# EAGLE design CF Grove Cape  v0.1 (EAGLE 8.0.2)

## Sheet 1 of 2
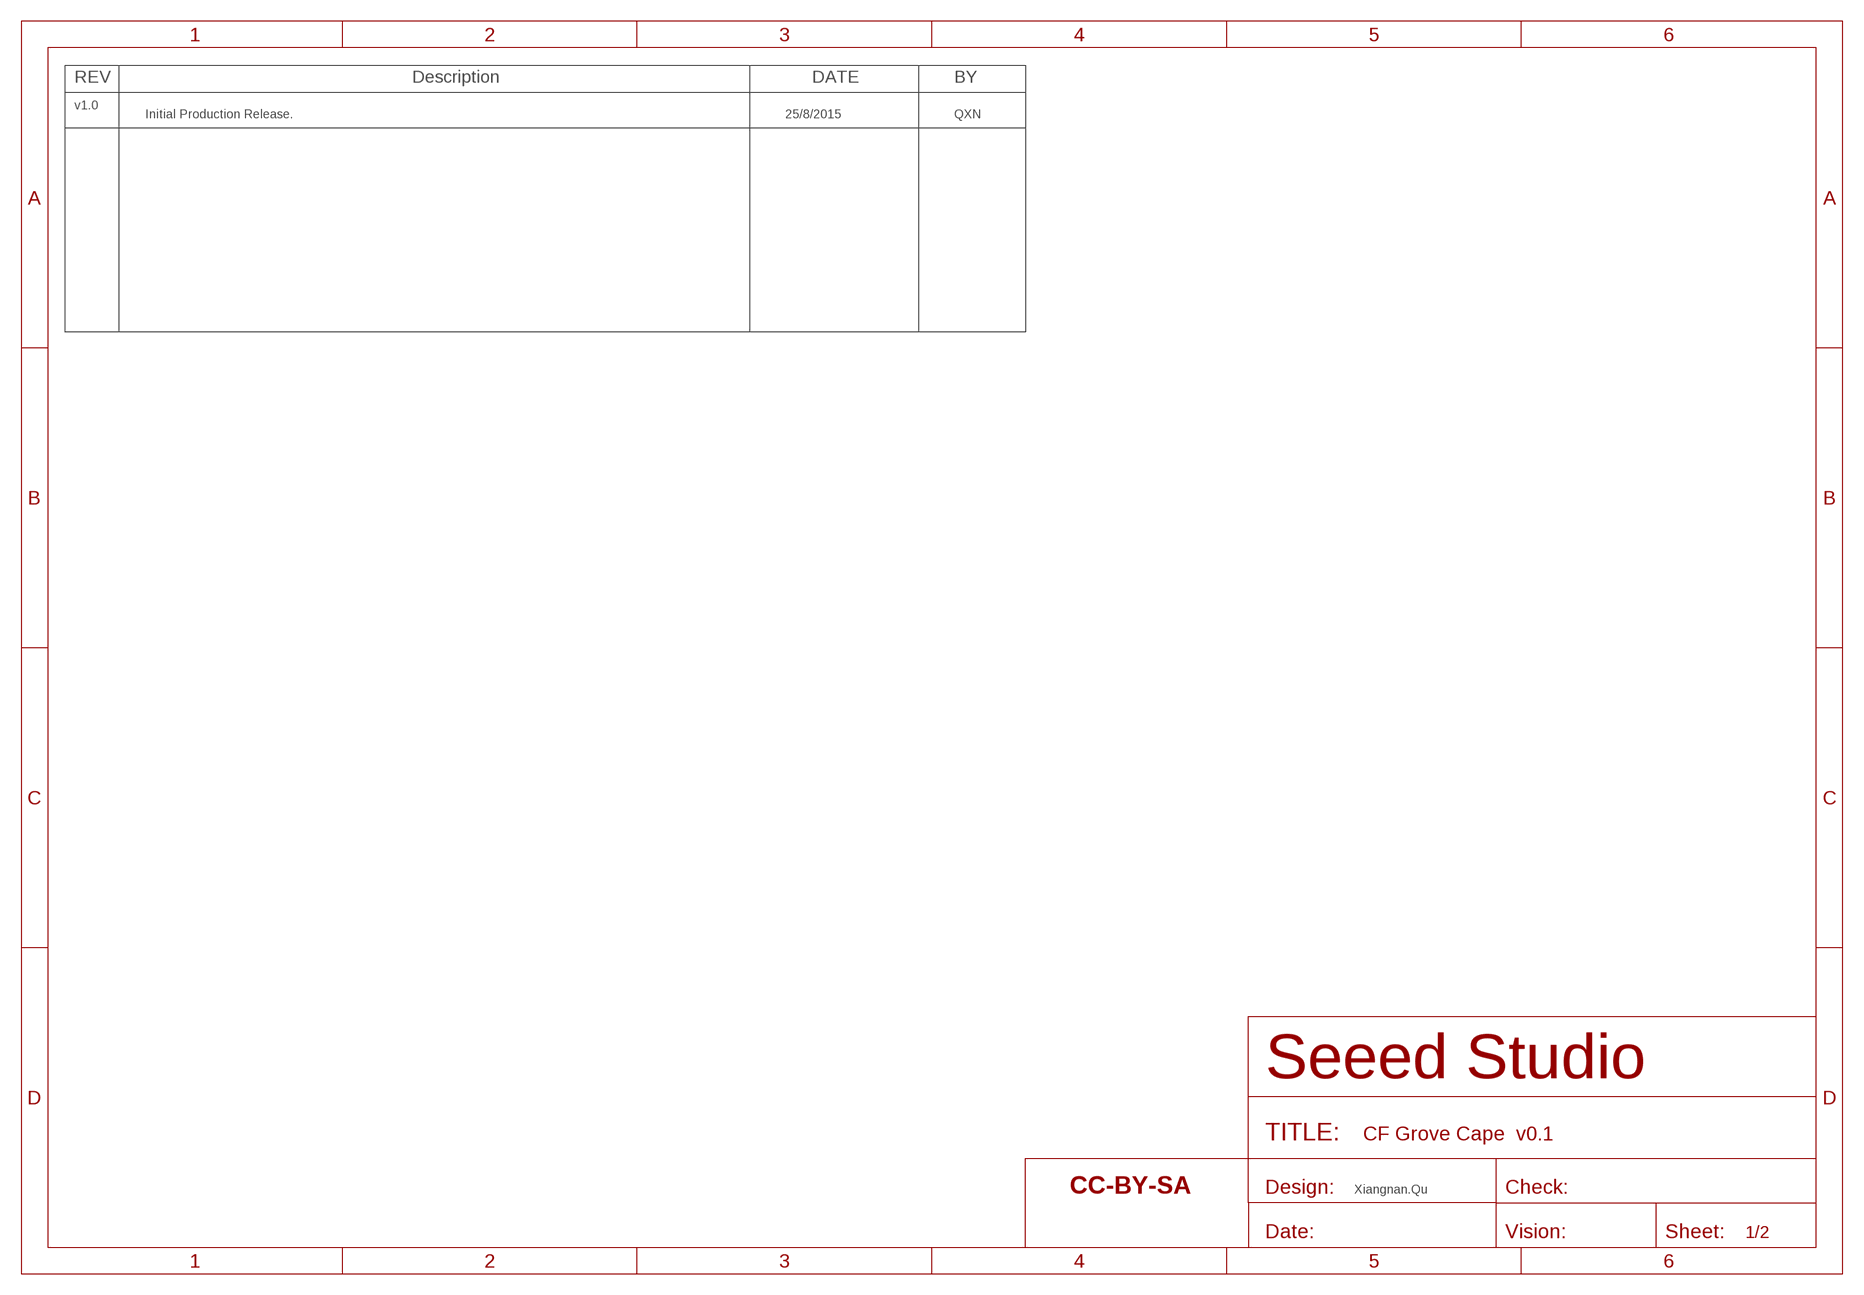
[diagram p0: schematic, sheet 1]

### Parts
FR1  SEEEDSTUDIO-OPEN-SCH-FRAME  [SEEEDSTUDIO-PCB-FRAME]

### Notes on the sheet
- REV | Description | DATE | BY
- v1.0
- Initial Production Release. | 25/8/2015 | QXN
- Xiangnan.Qu

## Sheet 2 of 2
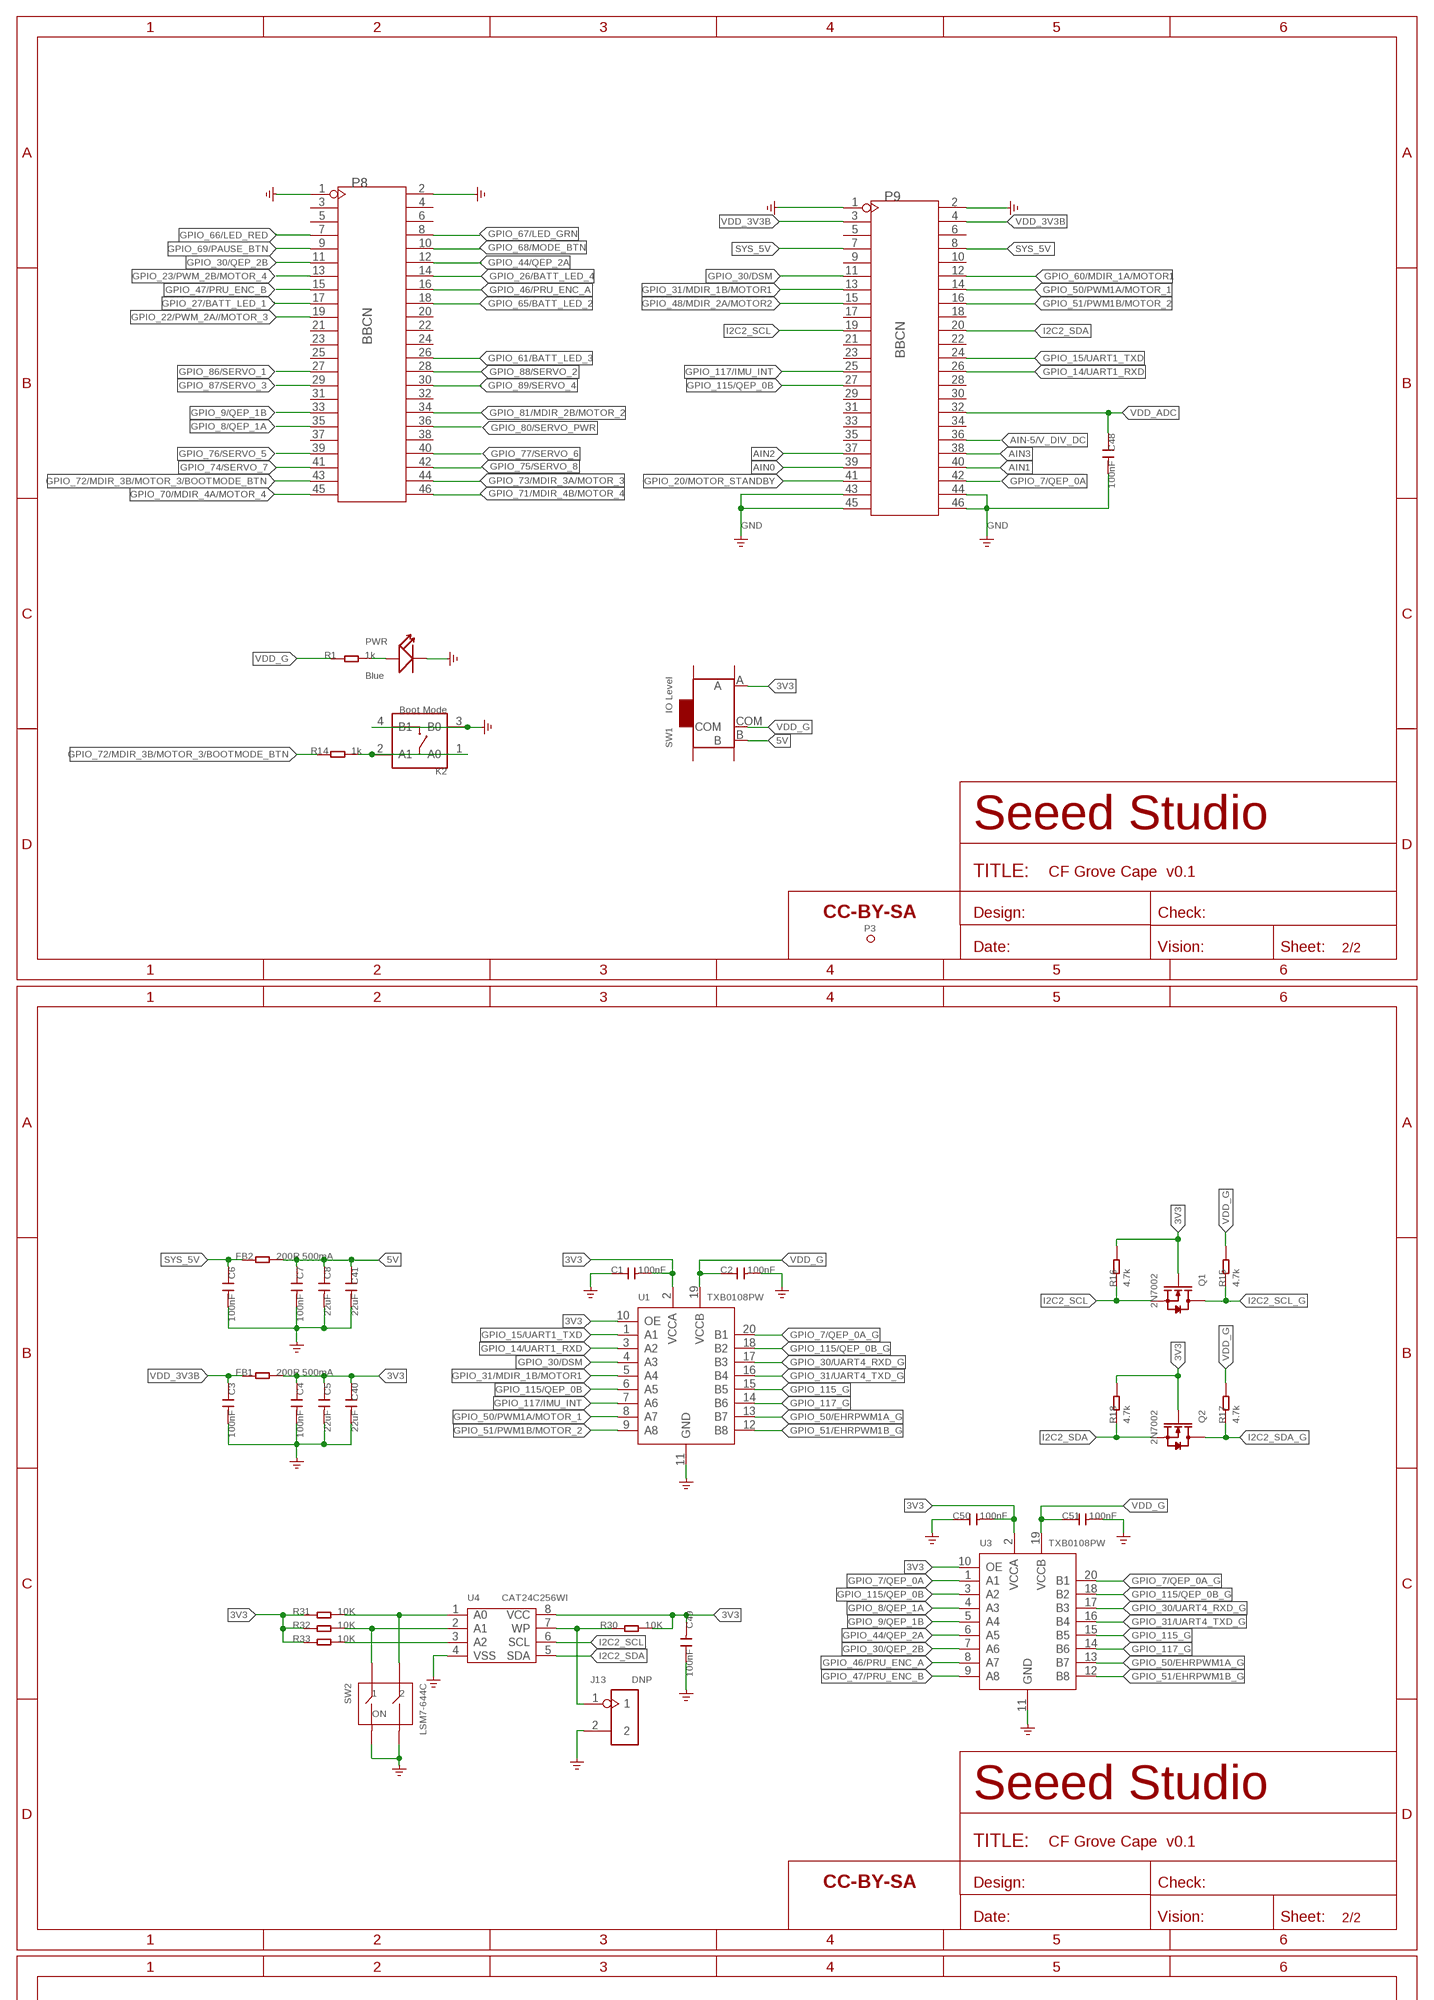
[diagram p1: schematic, sheet 2, part 1 of 2]
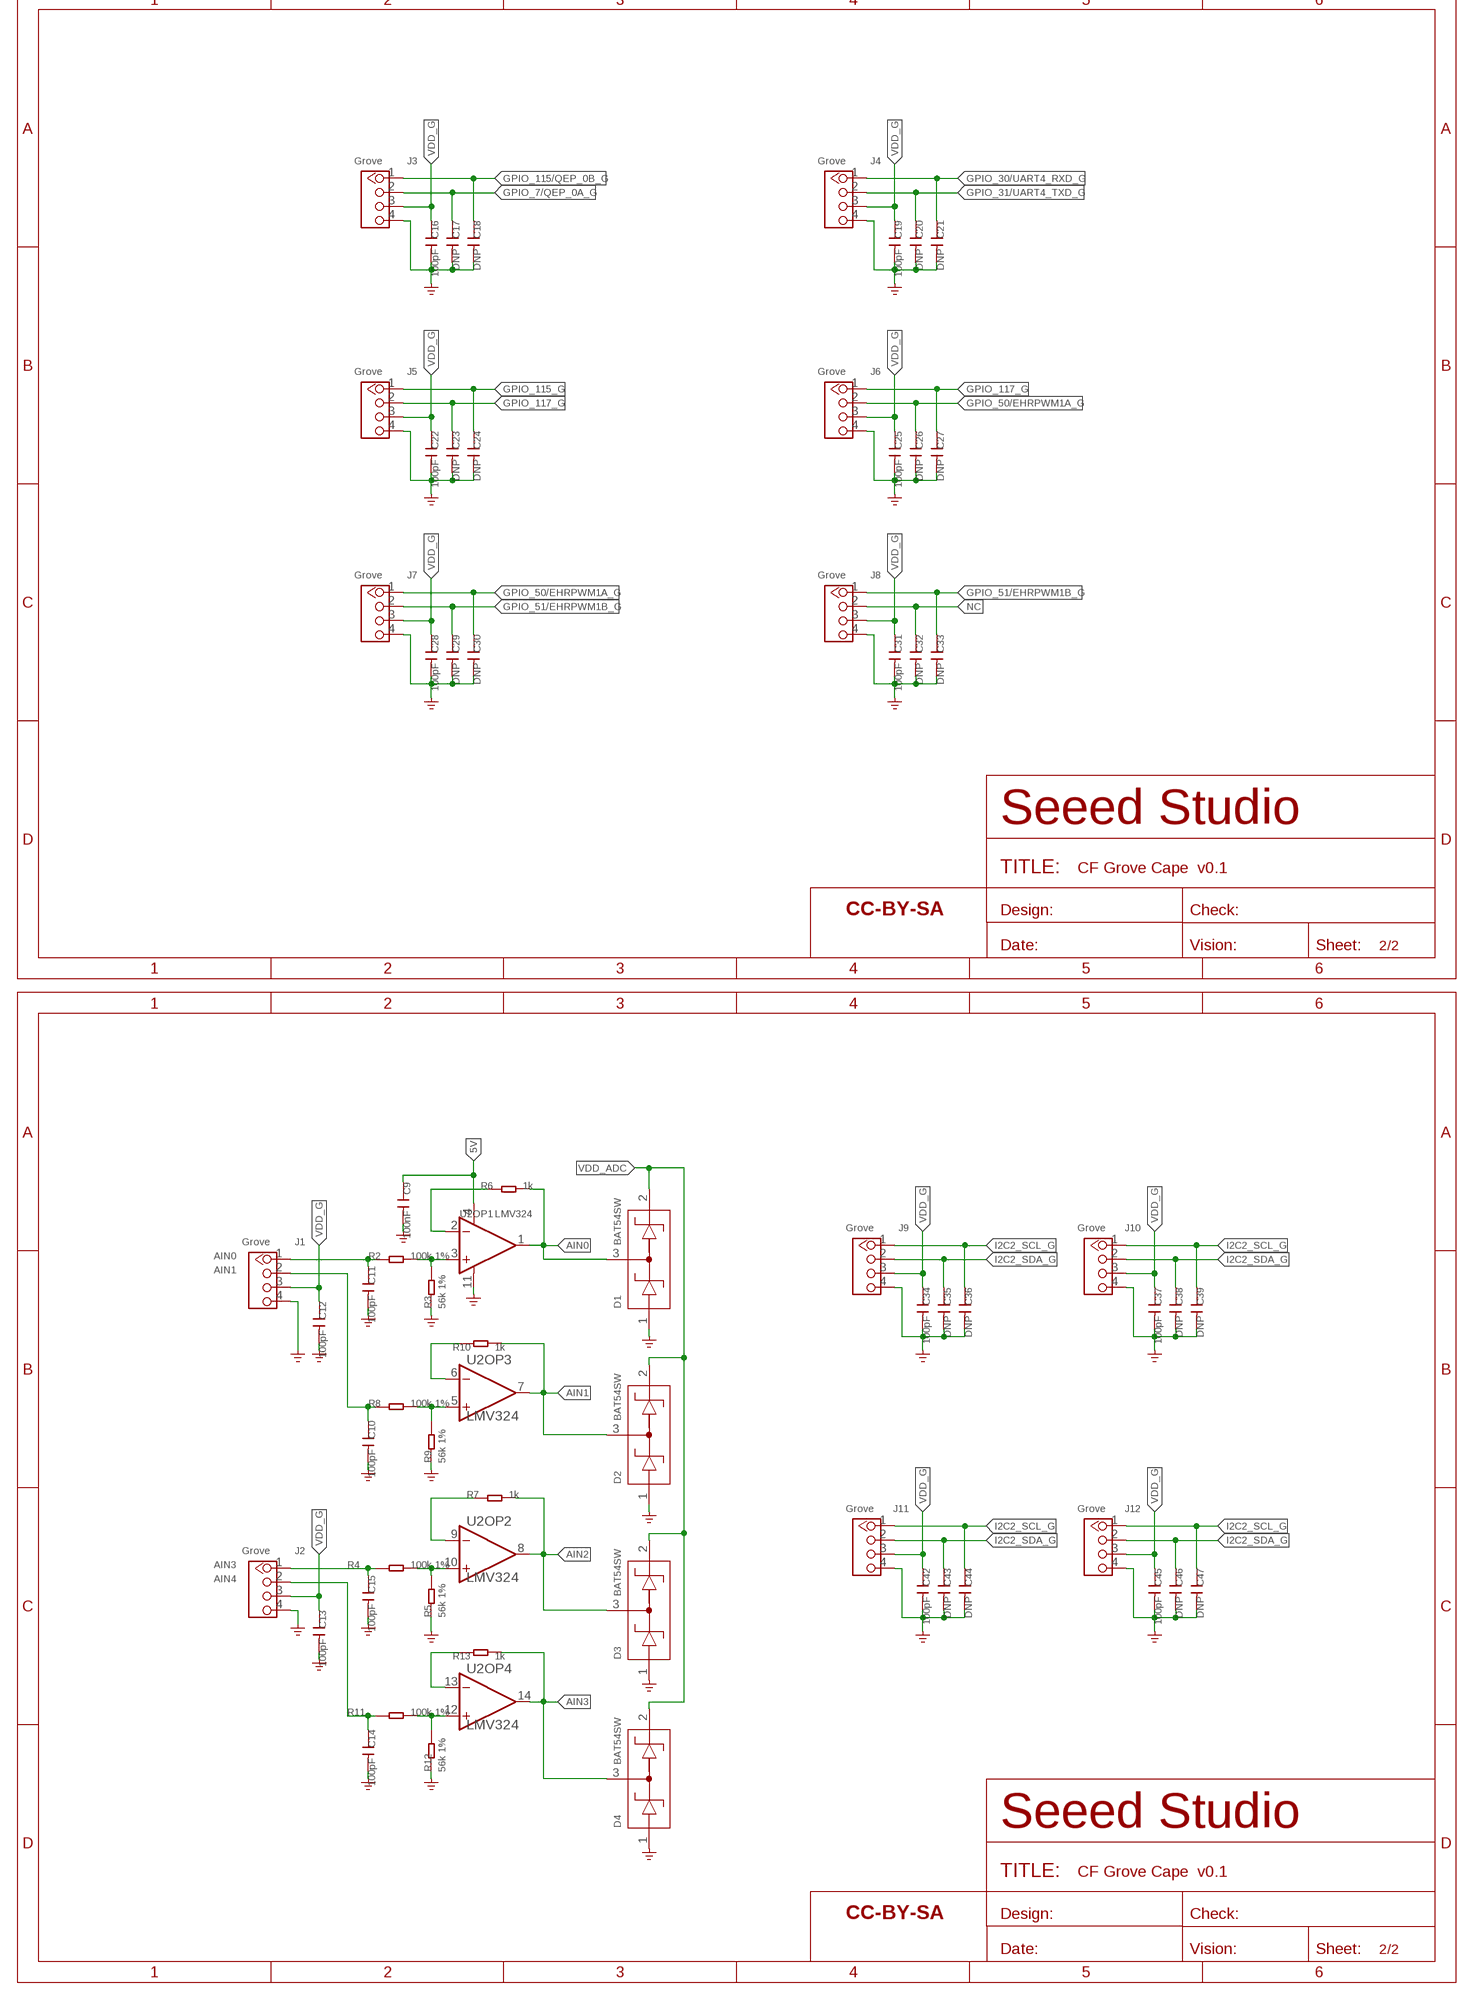
[diagram p2: schematic, sheet 2, part 2 of 2]

### Parts
C1  100nF  CAP-0402  [C0402]
C2  100nF  CAP-0402  [C0402]
C3  100nF  CAP-0402  [C0402]
C4  100nF  CAP-0402  [C0402]
C5  22uF  CAP-0805  [C0805]
C6  100nF  CAP-0402  [C0402]
C7  100nF  CAP-0402  [C0402]
C8  22uF  CAP-0805  [C0805]
C9  100nF  CAP-0402  [C0402]
C10  100pF  CAP-0402  [C0402]
C11  100pF  CAP-0402  [C0402]
C12  100pF  CAP-0402  [C0402]
C13  100pF  CAP-0402  [C0402]
C14  100pF  CAP-0402  [C0402]
C15  100pF  CAP-0402  [C0402]
C16  100pF  CAP-0402  [C0402]
C17  DNP  CAP-0402  [C0402]
C18  DNP  CAP-0402  [C0402]
C19  100pF  CAP-0402  [C0402]
C20  DNP  CAP-0402  [C0402]
C21  DNP  CAP-0402  [C0402]
C22  100pF  CAP-0402  [C0402]
C23  DNP  CAP-0402  [C0402]
C24  DNP  CAP-0402  [C0402]
C25  100pF  CAP-0402  [C0402]
C26  DNP  CAP-0402  [C0402]
C27  DNP  CAP-0402  [C0402]
C28  100pF  CAP-0402  [C0402]
C29  DNP  CAP-0402  [C0402]
C30  DNP  CAP-0402  [C0402]
C31  100pF  CAP-0402  [C0402]
C32  DNP  CAP-0402  [C0402]
C33  DNP  CAP-0402  [C0402]
C34  100pF  CAP-0402  [C0402]
C35  DNP  CAP-0402  [C0402]
C36  DNP  CAP-0402  [C0402]
C37  100pF  CAP-0402  [C0402]
C38  DNP  CAP-0402  [C0402]
C39  DNP  CAP-0402  [C0402]
C40  22uF  CAP-0805  [C0805]
C41  22uF  CAP-0805  [C0805]
C42  100pF  CAP-0402  [C0402]
C43  DNP  CAP-0402  [C0402]
C44  DNP  CAP-0402  [C0402]
C45  100pF  CAP-0402  [C0402]
C46  DNP  CAP-0402  [C0402]
C47  DNP  CAP-0402  [C0402]
C48  100nF  CAP-0402  [C0402]
C49  100nF  CAP-0402  [C0402]
C50  100nF  CAP-0402  [C0402]
C51  100nF  CAP-0402  [C0402]
D1  BAT54SW  D-SCHOTTKY-3P（BAT54SW)  [SOT-23]
D2  BAT54SW  D-SCHOTTKY-3P（BAT54SW)  [SOT-23]
D3  BAT54SW  D-SCHOTTKY-3P（BAT54SW)  [SOT-23]
D4  BAT54SW  D-SCHOTTKY-3P（BAT54SW)  [SOT-23]
FB1  200R 500mA  RES-0603  [R0603]
FB2  200R 500mA  RES-0603  [R0603]
FR2  SEEEDSTUDIO-OPEN-SCH-FRAME  [SEEEDSTUDIO-PCB-FRAME]
FR3  SEEEDSTUDIO-OPEN-SCH-FRAME  [SEEEDSTUDIO-PCB-FRAME]
FR4  SEEEDSTUDIO-OPEN-SCH-FRAME  [SEEEDSTUDIO-PCB-FRAME]
FR5  SEEEDSTUDIO-OPEN-SCH-FRAME  [SEEEDSTUDIO-PCB-FRAME]
J1  Grove  GROVE-CONNECTOR-DIP-2.0  [HW4-2.0]
J2  Grove  GROVE-CONNECTOR-DIP-2.0  [HW4-2.0]
J3  Grove  GROVE-CONNECTOR-DIP-2.0  [HW4-2.0]
J4  Grove  GROVE-CONNECTOR-DIP-2.0  [HW4-2.0]
J5  Grove  GROVE-CONNECTOR-DIP-2.0  [HW4-2.0]
J6  Grove  GROVE-CONNECTOR-DIP-2.0  [HW4-2.0]
J7  Grove  GROVE-CONNECTOR-DIP-2.0  [HW4-2.0]
J8  Grove  GROVE-CONNECTOR-DIP-2.0  [HW4-2.0]
J9  Grove  GROVE-CONNECTOR-DIP-2.0  [HW4-2.0]
J10  Grove  GROVE-CONNECTOR-DIP-2.0  [HW4-2.0]
J11  Grove  GROVE-CONNECTOR-DIP-2.0  [HW4-2.0]
J12  Grove  GROVE-CONNECTOR-DIP-2.0  [HW4-2.0]
J13  DNP  HEADER-2P-1.5  [H2-1.5]
K2  Boot Mode  BUTTON-4P-4.5X3.2  [SW4P-SMD-4.5X3.2X2.5MM]
P3  MARK-1.0'ANNULAR'  [ROUND-MARK-1.0]
P8  BBCN  HEADER-2X23P  [2X23P-2.54]
P9  BBCN  HEADER-2X23P  [2X23P-2.54]
PWR  Blue  LED-0402  [LED-0402]
Q1  2N7002  MOSFET-N'SOT23'  [SOT-23]
Q2  2N7002  MOSFET-N'SOT23'  [SOT-23]
R1  1k  RES-0402  [R0402]
R2  100k 1%  RES-0402  [R0402]
R3  56k 1%  RES-0402  [R0402]
R4  100k 1%  RES-0402  [R0402]
R5  56k 1%  RES-0402  [R0402]
R6  1k  RES-0402  [R0402]
R7  1k  RES-0402  [R0402]
R8  100k 1%  RES-0402  [R0402]
R9  56k 1%  RES-0402  [R0402]
R10  1k  RES-0402  [R0402]
R11  100k 1%  RES-0402  [R0402]
R12  56k 1%  RES-0402  [R0402]
R13  1k  RES-0402  [R0402]
R14  1k  RES-0402  [R0402]
R15  4.7k  RES-0402  [R0402]
R16  4.7k  RES-0402  [R0402]
R17  4.7k  RES-0402  [R0402]
R18  4.7k  RES-0402  [R0402]
R30  10K  RES-0402  [R0402]
R31  10K  RES-0402  [R0402]
R32  10K  RES-0402  [R0402]
R33  10K  RES-0402  [R0402]
SW1  IO Level  SWITCH-3+4P  [SW7-SMD-L6.7X2.7X3.2MM]
SW2  LSM7-644C  SWITCHES-4P'KM-02'  [SW4-SMD-5.08X6.8X3.3MM]
U1  TXB0108PW  LOGIC-TXS0108EPWR  [TSSOP20-0.65-6.5X4.4MM]
U2  LMV324  AMPLIFIER-LMV324'PW'  [TSSOP14-0.65-5X4.4MM]
U3  TXB0108PW  LOGIC-TXS0108EPWR  [TSSOP20-0.65-6.5X4.4MM]
U4  CAT24C256WI  MCU-EEPROM-CAT24C256  [SOIC8-1.27-5X4MM]

### Nets
3V3: C1.2 C4.1 C5.1 C40.1 C49.2 C50.2 FB1.2 Q1.1(G) Q2.1(G) R16.2 R18.2 R30.1 R31.2 R32.2 R33.2 SW1.A U1.2(VCCA) U1.10(OE) U3.2(VCCA) U3.10(OE) U4.8(VCC)
5V: C7.1 C8.1 C9.1 C41.1 FB2.2 SW1.B U2.4(OP1:V+)
AIN0: D1.3 P9.39 R6.2 U2.1(OP1:OUT)
AIN1: D2.3 P9.40 R10.2 U2.7(OP3:OUT)
AIN2: D3.3 P9.37 R7.2 U2.8(OP2:OUT)
AIN3: D4.3 P9.38 R13.2 U2.14(OP4:OUT)
AIN-5/V_DIV_DC: P9.36
GND: C1.1 C2.2 C3.2 C4.2 C5.2 C6.2 C7.2 C8.2 C9.2 C10.2 C11.2 C12.2 C13.2 C14.2 C15.2 C16.2 C17.2 C18.2 C19.2 C20.2 C21.2 C22.2 C23.2 C24.2 C25.2 C26.2 C27.2 C28.2 C29.2 C30.2 C31.2 C32.2 C33.2 C34.2 C35.2 C36.2 C37.2 C38.2 C39.2 C40.2 C41.2 C42.2 C43.2 C44.2 C45.2 C46.2 C47.2 C48.2 C49.1 C50.1 C51.2 D1.1 D2.1 D3.1 D4.1 J1.4 J2.4 J3.4 J4.4 J5.4 J6.4 J7.4 J8.4 J9.4 J10.4 J11.4 J12.4 J13.2 K2.3(B0) K2.4(B1) P8.1 P8.2 P9.1 P9.2 P9.43 P9.44 P9.45 P9.46 PWR.- R3.1 R5.1 R9.1 R12.1 SW2.3 SW2.4 U1.11(GND) U2.11(OP1:V-) U3.11(GND) U4.4(VSS) ; supply symbol labelled GND_POWER
GPIO_7/QEP_0A: P9.42 U3.1(A1)
GPIO_7/QEP_0A_G: C17.1 J3.2 U1.20(B1) U3.20(B1)
GPIO_8/QEP_1A: P8.35 U3.4(A3)
GPIO_9/QEP_1B: P8.33 U3.5(A4)
GPIO_14/UART1_RXD: P9.26 U1.3(A2)
GPIO_15/UART1_TXD: P9.24 U1.1(A1)
GPIO_20/MOTOR_STANDBY: P9.41
GPIO_22/PWM_2A//MOTOR_3: P8.19
GPIO_23/PWM_2B/MOTOR_4: P8.13
GPIO_26/BATT_LED_4: P8.14
GPIO_27/BATT_LED_1: P8.17
GPIO_30/DSM: P9.11 U1.4(A3)
GPIO_30/QEP_2B: P8.11 U3.7(A6)
GPIO_30/UART4_RXD_G: C21.1 J4.1 U1.17(B3) U3.17(B3)
GPIO_31/MDIR_1B/MOTOR1: P9.13 U1.5(A4)
GPIO_31/UART4_TXD_G: C20.1 J4.2 U1.16(B4) U3.16(B4)
GPIO_44/QEP_2A: P8.12 U3.6(A5)
GPIO_46/PRU_ENC_A: P8.16 U3.8(A7)
GPIO_47/PRU_ENC_B: P8.15 U3.9(A8)
GPIO_48/MDIR_2A/MOTOR2: P9.15
GPIO_50/EHRPWM1A_G: C26.1 C30.1 J6.2 J7.1 U1.13(B7) U3.13(B7)
GPIO_50/PWM1A/MOTOR_1: P9.14 U1.8(A7)
GPIO_51/EHRPWM1B_G: C29.1 C33.1 J7.2 J8.1 U1.12(B8) U3.12(B8)
GPIO_51/PWM1B/MOTOR_2: P9.16 U1.9(A8)
GPIO_60/MDIR_1A/MOTOR1: P9.12
GPIO_61/BATT_LED_3: P8.26
GPIO_65/BATT_LED_2: P8.18
GPIO_66/LED_RED: P8.7
GPIO_67/LED_GRN: P8.8
GPIO_68/MODE_BTN: P8.10
GPIO_69/PAUSE_BTN: P8.9
GPIO_70/MDIR_4A/MOTOR_4: P8.45
GPIO_71/MDIR_4B/MOTOR_4: P8.46
GPIO_72/MDIR_3B/MOTOR_3/BOOTMODE_BTN: P8.43 R14.1
GPIO_73/MDIR_3A/MOTOR_3: P8.44
GPIO_74/SERVO_7: P8.41
GPIO_75/SERVO_8: P8.42
GPIO_76/SERVO_5: P8.39
GPIO_77/SERVO_6: P8.40
GPIO_80/SERVO_PWR: P8.36
GPIO_81/MDIR_2B/MOTOR_2: P8.34
GPIO_86/SERVO_1: P8.27
GPIO_87/SERVO_3: P8.29
GPIO_88/SERVO_2: P8.28
GPIO_89/SERVO_4: P8.30
GPIO_115/QEP_0B: P9.27 U1.6(A5) U3.3(A2)
GPIO_115/QEP_0B_G: C18.1 J3.1 U1.18(B2) U3.18(B2)
GPIO_115_G: C24.1 J5.1 U1.15(B5) U3.15(B5)
GPIO_117/IMU_INT: P9.25 U1.7(A6)
GPIO_117_G: C23.1 C27.1 J5.2 J6.1 U1.14(B6) U3.14(B6)
I2C2_SCL: P9.19 Q1.2(S) R16.1 U4.6(SCL)
I2C2_SCL_G: C36.1 C39.1 C44.1 C47.1 J9.1 J10.1 J11.1 J12.1 Q1.3(D) R15.1
I2C2_SDA: P9.20 Q2.2(S) R18.1 U4.5(SDA)
I2C2_SDA_G: C35.1 C38.1 C43.1 C46.1 J9.2 J10.2 J11.2 J12.2 Q2.3(D) R17.1
N$1: R31.1 SW2.2 U4.1(A0)
N$2: R32.1 SW2.1 U4.2(A1)
N$3: K2.1(A0) K2.2(A1) R14.2
N$4: PWR.+ R1.2
N$5: R2.2 R3.2 U2.3(OP1:IN+)
N$8: R4.2 R5.2 U2.10(OP2:IN+)
N$10: C11.1 J1.1 R2.1
N$11: R6.1 U2.2(OP1:IN-)
N$12: J13.1 R30.2 U4.7(WP)
N$13: C15.1 J2.1 R4.1
N$16: R7.1 U2.9(OP2:IN-)
N$17: R33.1 U4.3(A2)
N$21: C14.1 J2.2 R11.1
N$22: R11.2 R12.2 U2.12(OP4:IN+)
N$24: C10.1 J1.2 R8.1
N$25: R8.2 R9.2 U2.5(OP3:IN+)
N$26: R10.1 U2.6(OP3:IN-)
N$27: R13.1 U2.13(OP4:IN-)
NC: C32.1 J8.2
SYS_5V: C6.1 FB2.1 P9.7 P9.8
VDD_3V3B: C3.1 FB1.1 P9.3 P9.4
VDD_ADC: C48.1 D1.2 D2.2 D3.2 D4.2 P9.32
VDD_G: C2.1 C12.1 C13.1 C16.1 C19.1 C22.1 C25.1 C28.1 C31.1 C34.1 C37.1 C42.1 C45.1 C51.1 J1.3 J2.3 J3.3 J4.3 J5.3 J6.3 J7.3 J8.3 J9.3 J10.3 J11.3 J12.3 R1.1 R15.2 R17.2 SW1.COM U1.19(VCCB) U3.19(VCCB)
Unconnected: P8.3 P8.4 P8.5 P8.6 P8.20 P8.21 P8.22 P8.23 P8.24 P8.25 P8.31 P8.32 P8.37 P8.38 P9.5 P9.6 P9.9 P9.10 P9.17 P9.18 P9.21 P9.22 P9.23 P9.28 P9.29 P9.30 P9.31 P9.33 P9.34 P9.35 SW1.SS1 SW1.SS2 SW1.SS3 SW1.SS4

### Notes on the sheet
- AIN0
- AIN1
- AIN3
- AIN4

## Library data of the parts
C1-C51 = Discrete-new:CAP: Ceramic Capacitors
D1-D4 = Discrete-new:D-SCHOTTKY-3P（BAT54SW)
FB1 FB2 R1-R18 R30-R33 = Discrete-new:RES
FR1-FR5 = moudle-new:SEEEDSTUDIO-OPEN-SCH-FRAME
J1-J12 = Connector-new:GROVE-CONNECTOR-DIP: 4P-2.0:320110033;4P-2.0-90D:320110034
J13 = Connector-new:HEADER-2P
K2 = Discrete-new:BUTTON-4P: SW4-6.0X6.0X5.0MM:311020024;SW4-8.0X8.0X9.0MM:311020028;SW4-SMD-6.0X6.0X5.0MM:311020004;SW4-SMD-3.35X3.35X1.5MM:311020030;SW4-SMD-5.2X5.2X2.5MM:311020046
P3 = Discrete-new:MARK-1.0; PARTNO: DNP
P8 P9 = Connector :HEADER-2X23P
PWR = Discrete-new:LED
Q1 Q2 = Discrete-new:MOSFET-N
SW1 = Discrete-new:SWITCH-3+4P: SW7-SMD-6.7X2.6X1.4MM-90D:311030002;SW7-SMD-L6.7X2.7X3.2MM:311030001
SW2 = Discrete-new:SWITCHES-4P
U1 U3 = IC-new:LOGIC-TXS0108EPWR: 310050026
U2 = IC-new:AMPLIFIER-LMV324: TSSOP-14:310020008;SOIC-14:310020019
U4 = template:MCU-EEPROM-CAT24C256: 256 kb I2C CMOS Serial EEPROM

## Board
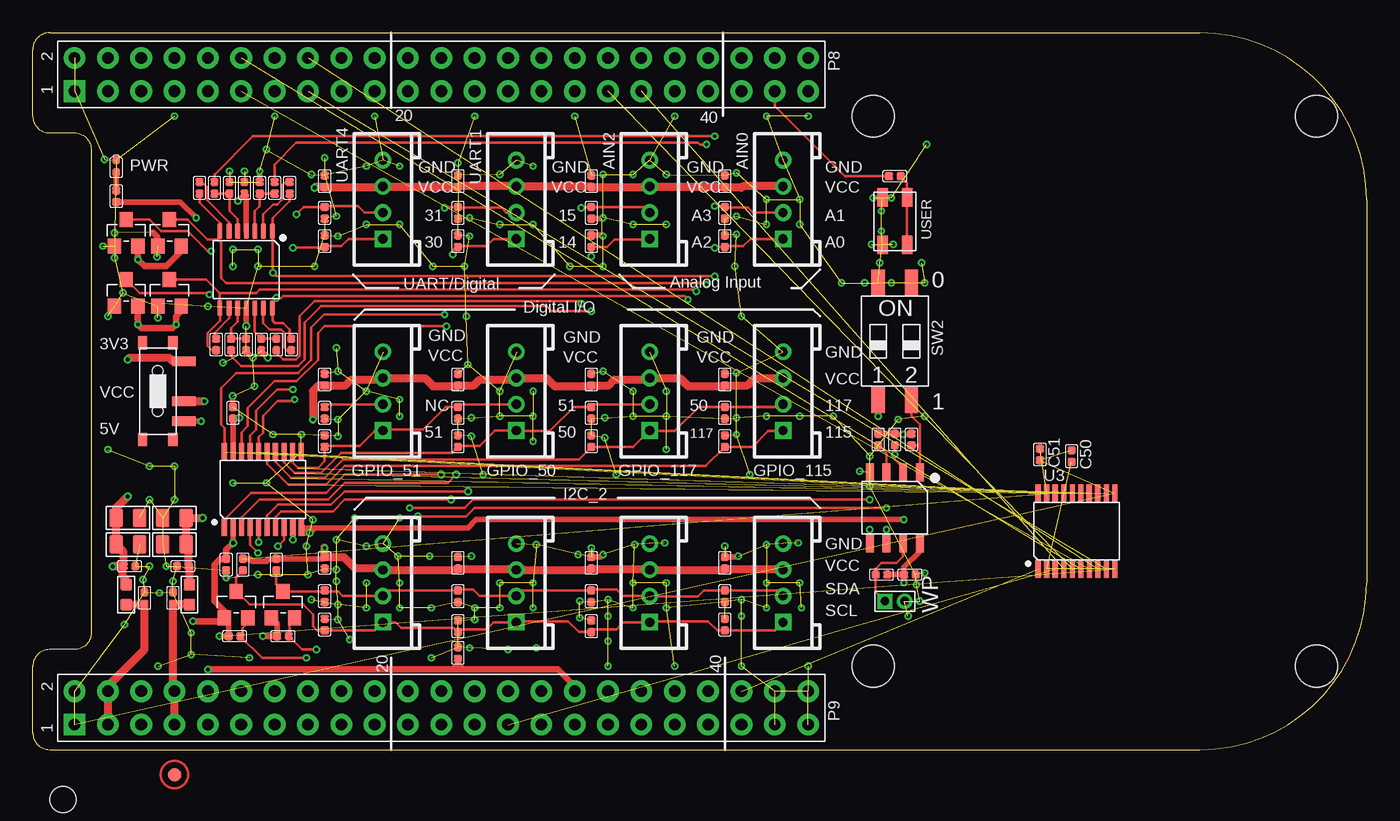
[diagram p3: board, top side]
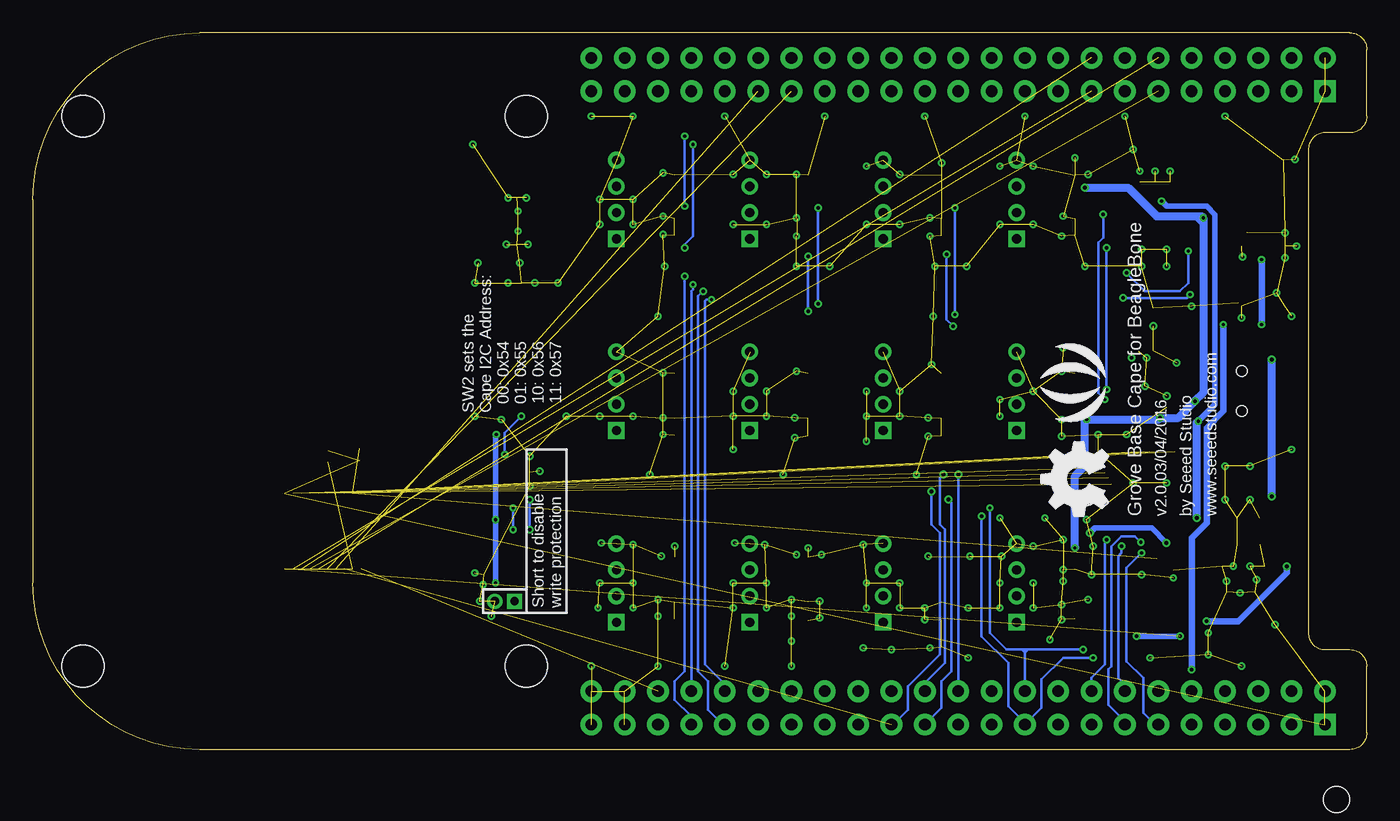
[diagram p4: board, bottom side, seen from below]

Size 101.6 x 54.61 mm. Coordinates in mm from the lower left corner, seen from the top.
Outline: 0,1.27 arc90 1.27,0
Outline: 88.9,0 arc90 101.6,12.7
Outline: 101.6,12.7 101.6,41.91 arc90 88.9,54.61 1.27,54.61 arc90 0,53.34 0,48.26 arc90 1.27,46.99 3.17,46.99 arc-90 4.45,45.72 4.45,8.89 arc-90 3.17,7.62 1.27,7.62 arc90 0,6.35 0,1.27
Outline: 0,1.27 arc90 1.27,0
Outline: 1.27,0 88.9,0
Outline: 88.9,0 arc90 101.6,12.7
Copper layers (1*16): Top 0.035mm / dielectric 1.5mm / Bottom 0.035mm
Design rules "SeeedStudio_2layer_DRU_no_angle_20140221 *": minimum track width 1mil, minimum drill 10mil, track to track 6mil, track to pad 6mil, pad to pad 6mil, via to via 6mil, smd to smd 0mil, copper to edge 10mil, drill to drill 10mil, minimum pad ring 10mil, minimum via ring 6mil, stop-mask expansion 2mil, vias tented up to drill 25mil, thermal gap 10mil
Holes 2 mm at 2.29,-3.81

### Footprints (pad centres in the part's own frame; a part is rotated, then mirrored left to right if it is on the bottom)
C0402 = smd 0.635 x 0.635: 1 0,0.445; 2 0,-0.445
C0805 = smd 1.397 x 1.016: 1 0,0.889; 2 0,-0.889
SOT-23 = smd 1.016 x 1.143: 1 -0.889,-1.016; 2 0.889,-1.016; 3 0,1.016
R0603 = smd 0.889 x 0.889: 1 0,0.762; 2 0,-0.762
HW4-2.0 = drill 0.7 pad 1.27 square: 1 -3,0 | drill 0.7 pad 1.27: 2 -1,0; 3 1,0; 4 3,0
H2-1.5 = drill 0.635 pad 1.016 square: 1 0,0.75 | drill 0.635 pad 1.016: 2 0,-0.75
SW4P-SMD-4.5X3.2X2.5MM = smd 1.4 x 0.8: 1 -1.8,-0.94; 2 1.8,-0.94; 3 1.8,0.94; 4 -1.8,0.94
ROUND-MARK-1.0 = smd 1.016 x 1.016: P$1 0,0
2X23P-2.54 = drill 0.889 pad 1.651 square: 1 -1.27,27.94 | drill 0.889 pad 1.651: 2 1.27,27.94; 3 -1.27,25.4; 4 1.27,25.4; 5 -1.27,22.86; 6 1.27,22.86; 7 -1.27,20.32; 8 1.27,20.32; 9 -1.27,17.78; 10 1.27,17.78; 11 -1.27,15.24; 12 1.27,15.24; 13 -1.27,12.7; 14 1.27,12.7; 15 -1.27,10.16; 16 1.27,10.16; 17 -1.27,7.62; 18 1.27,7.62; 19 -1.27,5.08; 20 1.27,5.08; 21 -1.27,2.54; 22 1.27,2.54; 23 -1.27,0; 24 1.27,0; 25 -1.27,-2.54; 26 1.27,-2.54; 27 -1.27,-5.08; 28 1.27,-5.08; 29 -1.27,-7.62; 30 1.27,-7.62; 31 -1.27,-10.16; 32 1.27,-10.16; 33 -1.27,-12.7; 34 1.27,-12.7; 35 -1.27,-15.24; 36 1.27,-15.24; 37 -1.27,-17.78; 38 1.27,-17.78; 39 -1.27,-20.32; 40 1.27,-20.32; 41 -1.27,-22.86; 42 1.27,-22.86; 43 -1.27,-25.4; 44 1.27,-25.4; 45 -1.27,-27.94; 46 1.27,-27.94
LED-0402 = smd 0.58 x 0.58: + -0.468,0; - 0.468,0
R0402 = smd 0.635 x 0.635: 1 0,0.445; 2 0,-0.445
SW7-SMD-L6.7X2.7X3.2MM = smd 1.8 x 0.7: A 1.978,2.286; B 1.978,-2.286; COM 1.978,-0.762 | smd 0.7 x 1.016: SS1 -1.15,-3.683; SS2 1.15,-3.683; SS3 1.15,3.683; SS4 -1.15,3.683 | hole 0.813: 0,-1.524; 0,1.524
SW4-SMD-5.08X6.8X3.3MM = smd 1.016 x 2.032: 1 -1.27,-4.445; 2 1.27,-4.445; 3 1.27,4.445; 4 -1.27,4.445
TSSOP20-0.65-6.5X4.4MM = smd 0.4 x 1.35: 1 -2.925,-2.875; 2 -2.275,-2.875; 3 -1.625,-2.875; 4 -0.975,-2.875; 5 -0.325,-2.875; 6 0.325,-2.875; 7 0.975,-2.875; 8 1.625,-2.875; 9 2.275,-2.875; 10 2.925,-2.875; 11 2.91,2.875; 12 2.26,2.875; 13 1.61,2.875; 14 0.96,2.875; 15 0.325,2.875; 16 -0.325,2.875; 17 -0.975,2.875; 18 -1.625,2.875; 19 -2.275,2.875; 20 -2.925,2.875
TSSOP14-0.65-5X4.4MM = smd 0.4 x 1.2: 1 -2,-2.925; 2 -1.3,-2.925; 3 -0.65,-2.925; 4 0,-2.925; 5 0.65,-2.925; 6 1.3,-2.925; 7 2,-2.925; 8 2,2.925; 9 1.3,2.925; 10 0.65,2.925; 11 0,2.925; 12 -0.65,2.925; 13 -1.3,2.925; 14 -2,2.925
SOIC8-1.27-5X4MM = smd 0.6 x 1.4: 1 -1.905,-2.7; 2 -0.635,-2.7; 3 0.635,-2.7; 4 1.905,-2.7; 5 1.905,2.7; 6 0.635,2.7; 7 -0.635,2.7; 8 -1.905,2.7
HOLE-3.2/7.0 = hole 3.2: 0,0

### Placement (x,y rotation side)
C1  14.73,14.1 180 top
C2  15.24,25.65 180 top
C3  8.51,11.56 180 top
C4  7.37,13.97 90 top
C5  7.24,15.62 90 top
C6  10.67,11.56 180 top
C7  11.43,13.97 270 top
C8  10.79,17.65 270 top
C9  16.13,42.8 180 top
C10  52.7,40.89 0 top
C11  52.7,38.73 180 top
C12  52.7,43.31 180 top
C13  42.55,43.31 180 top
C14  42.55,40.89 0 top
C15  42.55,38.73 180 top
C16  32.38,43.31 180 top
C17  32.38,40.89 0 top
C18  32.38,38.73 180 top
C19  22.23,43.31 180 top
C20  22.23,40.89 0 top
C21  22.23,38.73 180 top
C22  52.7,28.19 180 top
C23  52.7,25.65 0 top
C24  52.7,23.5 180 top
C25  42.55,28.19 180 top
C26  42.55,25.65 0 top
C27  42.55,23.5 180 top
C28  32.38,28.19 180 top
C29  32.38,25.65 0 top
C30  32.38,23.5 180 top
C31  22.23,28.19 180 top
C32  22.23,25.65 0 top
C33  22.23,23.5 180 top
C34  52.7,14.22 180 top
C35  52.7,11.68 0 top
C36  52.7,9.53 180 top
C37  42.55,14.22 180 top
C38  42.55,11.68 0 top
C39  42.55,9.4 180 top
C40  7.24,17.65 90 top
C41  10.79,15.62 270 top
C42  32.38,14.22 180 top
C43  32.38,11.68 0 top
C44  32.38,9.4 180 top
C45  22.23,14.22 0 top
C46  22.23,11.68 0 top
C47  22.23,9.53 180 top
C48  32.38,7.37 180 top
C49  66.8,13.34 270 top
C50  79.12,22.35 0 top
C51  76.71,22.48 0 top
D1  7.11,39.37 0 top
D2  10.41,39.37 0 top
D3  10.41,34.8 0 top
D4  7.11,34.8 0 top
FB1  7.11,11.81 180 top
FB2  11.94,11.81 180 top
FR1  18.29,-19.56 0 top  (outside the outline)
FR2  18.29,-19.56 0 top  (outside the outline)
FR3  -3.94,-47.5 0 top  (outside the outline)
FR4  18.29,-19.56 0 top  (outside the outline)
FR5  -4.45,-54.1 0 top  (outside the outline)
J1  57.15,41.91 90 top
J2  46.99,41.91 90 top
J3  36.83,41.91 90 top
J4  26.67,41.91 90 top
J5  57.15,27.3 90 top
J6  46.99,27.3 90 top
J7  36.83,27.3 90 top
J8  26.67,27.3 90 top
J9  57.15,12.7 90 top
J10  46.99,12.7 90 top
J11  36.83,12.7 90 top
J12  26.67,12.7 90 top
J13  65.66,11.3 90 top
K2  65.66,40.26 90 top
P3  10.79,-1.91 0 top
P8  31.11,51.44 90 top
P9  31.11,3.17 90 top
PWR  6.35,44.45 90 top
Q1  15.49,11.05 0 top
Q2  19.05,11.05 0 top
R1  6.35,42.16 180 top
R2  18.41,42.8 0 top
R3  17.27,42.8 0 top
R4  15.11,30.86 180 top
R5  16.26,30.86 180 top
R6  19.56,42.8 0 top
R7  13.97,30.86 0 top
R8  13.84,42.8 0 top
R9  14.99,42.8 0 top
R10  12.7,42.8 0 top
R11  18.54,30.86 180 top
R12  17.4,30.86 180 top
R13  19.68,30.86 180 top
R14  65.66,43.69 90 top
R15  16,14.1 180 top
R16  15.37,8.64 270 top
R17  18.54,14.1 180 top
R18  19.05,8.64 270 top
R30  64.64,13.34 270 top
R31  66.93,23.62 180 top
R32  65.66,23.62 180 top
R33  64.39,23.62 180 top
SW1  9.53,27.3 0 top
SW2  65.66,31.11 0 top
U1  17.53,19.81 0 top
U2  16.26,36.58 180 top
U3  79.5,16.64 0 top
U4  65.66,18.41 180 top
U$16  [SEEED-SILK-280*268MIL]  21.59,27.94 90 bottom
U$18  [OSHW_FILLX200_NOTEXT]  19.68,17.78 90 bottom
U$26  [HOLE-3.2/7.0]  64.01,48.26 0 top
U$27  [HOLE-3.2/7.0]  64.01,6.35 0 top
U$50  [HOLE-3.2/7.0]  97.79,6.35 0 top
U$51  [HOLE-3.2/7.0]  97.79,48.26 0 top

### Tracks (layer width: path | path; a pad name or v marks a point on that pad's centre or on a via)
3V3  (via drill 0.25, 0.3)  (3 unrouted)
  Top 0.406: Q2.1 18.61,9.59 R18.2 v17.53,8.64 | v14.22,8.64 R16.2 14.92,9.72 Q1.1 | U1.2 v15.25,15.76 | 21.08,16.89 20.5,16.89 U1.10 | 21.08,16.89 21.46,16.89 | v21.08,16.51 20.7,16.51 20.57,16.64 | v21.08,16.51 21.08,16.89 | 21.46,16.89 v21.08,16.51 | U4.8 67.56,15.11 66.36,13.91 C49.2 | C49.2 v66.36,12.7 | R30.1 C49.2 | R33.2 R32.2 65.72,24 v66.29,24 66.86,24 R31.2 | 21.46,16.89 33.15,16.89 33.78,17.53 v66.36,17.53
  Top 0.508: v15.25,15.76 14.73,15.24 C1.2 14.67,14.48 14.22,14.48 13.84,14.1 13.84,11.3 14.61,10.54 Q1.1 14.35,9.78 v12.19,9.78
  Top 0.61: FB1.2 7.11,12.95 6.86,13.21 6.86,13.91 C4.1 | C4.1 6.92,15.05 C5.1 C40.1 6.35,18.41 v7.24,19.3 | SW1.A 10.67,29.59 10.41,29.84 7.37,29.84 v7.24,29.72 | C4.1 v6.1,13.97
  Bottom 0.406: v17.53,8.64 v14.22,8.64 | v15.25,15.76 16.38,16.89 20.7,16.89 v21.08,16.51 | v66.36,12.7 v66.36,17.53 66.36,23.94 v66.29,24
  Bottom 0.508: v6.1,13.97 6.1,13.46 9.78,9.78 v12.19,9.78
  Bottom 0.61: v7.24,19.3 v7.24,29.72
5V  (via drill 0.25, 0.3)
  Top 0.406: U2.4 16.26,42.23 C9.1 16.13,42.29 v15.62,41.78 | v12.83,25.02 SW1.B
  Top 0.61: v12.95,17.65 C8.1 C41.1 11.87,15.43 C7.1 11.94,13.91 FB2.2
  Bottom 0.406: v12.83,25.02 11.56,26.29 11.56,40.77 12.19,41.4 15.24,41.4 v15.62,41.78
  Bottom 0.61: v12.95,17.65 12.95,24.89 v12.83,25.02
AIN0  (via drill 0.25)
  Top 0.203: R6.2 19.56,41.78 18.26,40.48 U2.1 18.26,36.35 v18.29,36.32 18.54,36.07 v51.94,36.07 | v13.59,37.97 13.34,37.97 11.81,39.5 9.78,39.5 8.89,40.39 D1.3
  Bottom 0.203: P9.39 51.44,2.54 52.7,3.81 52.7,5.21 51.94,5.97 v51.94,36.07 | v13.59,37.97 13.59,35.56 14.22,34.92 16.89,34.92 v18.29,36.32
AIN1  (via drill 0.25)
  Top 0.203: R10.2 12.7,41.66 14.26,40.1 U2.7 14.26,39.02 14.1,38.86 | v51.31,35.43 51.18,35.56 14.73,35.56 14.35,35.94 14.35,38.61 14.1,38.86 | 14.1,38.86 13.34,38.86 11.81,40.39 D2.3
  Bottom 0.203: P9.40 51.44,34.92 51.31,35.05 v51.31,35.43
AIN2  (via drill 0.25)
  Top 0.203: R7.2 13.65,30.42 13.34,30.73 13.34,31.75 14.26,32.67 U2.8 14.22,33.68 14.22,34.8 | 14.22,34.8 13.21,35.81 D3.3 | 14.22,34.8 17.02,34.8 17.27,35.05 50.42,35.05 v50.55,34.92
  Bottom 0.203: P9.37 49.02,1.91 50.16,3.05 50.16,5.21 50.93,5.97 50.93,34.54 v50.55,34.92
AIN3  (via drill 0.25)
  Top 0.203: R13.2 19.56,31.43 19.56,32 19.05,32.51 18.41,32.51 18.26,32.67 U2.14 18.26,34.13 v18.54,34.42 18.92,34.42 19.05,34.54 49.66,34.54 v49.91,34.29 | D4.3 8.13,34.8 13.34,34.8 v13.46,34.67
  Bottom 0.203: P9.38 48.9,4.95 50.42,6.48 50.42,34.16 50.29,34.29 v49.91,34.29 | v18.54,34.42 13.72,34.42 v13.46,34.67
GND  (via drill 0.25, 0.3)  (281 unrouted)
  Top 0.406: R12.1 17.4,30.35 v17.91,29.84 | R5.1 16.26,30.35 v16.76,29.84 | C14.2 43.37,40.45 v43.43,40.51 | C15.2 43.37,39.18 v43.43,39.12 | C34.2 53.66,14.67 v53.72,14.73 | C37.2 43.24,14.67 v43.43,14.86 | C1.1 v14.73,13.08 | R3.1 v17.27,44.07 | C2.2 v15.24,26.92 | U2.11 v16.26,32.26 | D3.1 9.78,34.04 | 9.78,38.61 D2.1 9.53,39.05 9.14,39.43
  other vias: 33.4,14.73 15.24,20.32 21.34,17.53 23.24,23.88 23.24,25.15 23.24,28.83 33.15,29.34 33.4,25.27 33.4,23.88 43.43,28.83 43.56,25.27 43.56,23.75 53.59,28.7 53.59,25.27 53.59,24 53.59,39.24 53.59,40.64 53.59,43.94 43.43,43.81 32.38,44.7 33.27,40.51 33.27,39.12 23.11,40.64 23.24,39.12 21.21,43.81 16.13,44.07 14.99,44.07 10.67,12.83 8.38,12.95 8.89,19.05 10.79,19.05 10.79,21.59 8.89,21.59 23.11,13.72 23.11,12.83 23.24,11.05 23.24,9.91 20.95,13.34 21.21,11.43 27.94,10.79 25.4,10.79 35.56,10.79 38.1,10.79 33.66,10.79 33.66,9.91 43.81,11.43 43.81,10.16 45.72,10.79 48.26,10.79 55.88,10.79 53.98,11.43 53.98,10.16 58.55,10.79 22.23,45.09 17.78,45.72 27.94,44.45 25.4,44.45 35.56,40.01 25.4,40.01 27.94,40.01 38.1,40.01 38.1,44.45 35.56,43.81 45.72,43.81 48.26,43.81 45.72,40.01 48.26,40.01 55.88,40.01 55.88,41.91 58.42,41.91 58.42,40.01 55.88,25.4 58.42,25.4 45.72,25.4 48.26,22.86 38.1,23.5 35.56,25.4 38.1,25.4 27.94,26.67 35.56,27.3 38.1,27.3 45.72,27.3 48.26,27.3 48.26,25.4 27.94,25.4 25.4,27.3 15.24,38.1 15.24,36.83 17.14,38.1 17.14,36.83 25.4,12.7 27.94,12.7 35.56,12.7 38.1,12.7 45.72,12.7 48.26,12.7 55.88,12.7 58.42,12.7 6.86,34.8 17.78,20.32 12.06,8.89 8.89,13.97 6.99,9.53 12.06,7.24 16.51,6.99 17.14,13.34 13.34,33.78 10.79,48.26 18.41,48.26 26.04,48.26 33.66,48.26 41.27,48.26 48.9,48.26 55.88,48.26 59.05,48.26 9.53,6.35 43.81,6.35 48.9,6.35 53.98,6.35 59.05,6.35 68.07,46.1 61.59,35.56 5.71,22.86 5.71,33.02 53.98,33.02 33.02,33.02 23.11,30.61 21.46,36.83 30.48,36.83 32.89,36.83 40.89,36.83 43.43,36.83 53.47,36.83 34.29,20.95 30.23,14.73 30.35,10.79 30.35,6.99 24.13,8.38 33.27,7.75 43.81,8.26 18.29,24 20.45,24 6.22,37.47 5.33,38.35 9.53,32.89 9.46,37.53 5.46,44.96 6.22,39.37 14.48,29.46 16.89,27.69 10.16,13.97 9.65,11.94 20.83,15.49 25.4,15.49 27.81,14.73 41.53,14.86 41.66,11.3 41.66,10.03 36.2,7.62 38.35,7.75 52.7,15.49 62.99,21.21 63.75,22.35 63.37,35.56 65.41,35.56 67.94,35.56 67.69,37.08 64.64,41.02 64.01,42.04 64.64,39.5 65.53,38.48 63.88,38.48 64.52,37.08 65.41,42.04 65.91,25.15 63.75,20.07 67.94,13.46 67.31,12.57 44.45,20.95 54.61,20.95 60.96,25.4 67.94,25.4 27.94,17.65 24.51,17.65 23.11,16 38.35,15.62 42.55,15.37 45.85,15.62 48.13,15.75 55.88,15.62 58.29,15.75 67.56,11.3 66.67,10.16
GPIO_7/QEP_0A  (1 unrouted)
GPIO_7/QEP_0A_G  (via drill 0.25)  (1 unrouted)
  Top 0.203: J3.2 36.05,40.91 35.69,41.27 32.45,41.27 C17.1 31.43,41.34 v31.37,41.27 | U1.20 14.6,24.52 14.35,24.77 14.35,27.56 15.49,28.7 20.22,28.7 21.21,29.69 21.21,32.16 22.2,33.15 v31.37,33.15
  Bottom 0.203: v31.37,41.27 v31.37,33.15
GPIO_8/QEP_1A  (1 unrouted)
GPIO_9/QEP_1B  (1 unrouted)
GPIO_14/UART1_RXD  (via drill 0.3)
  Top 0.203: U1.3 15.9,17.68 17.27,19.05 22.48,19.05 23.75,20.32 31.62,20.32 v32.26,20.95
  Bottom 0.203: P9.26 33.66,5.08 32.13,6.6 32.13,16.76 32.51,17.14 32.51,20.7 v32.26,20.95
GPIO_15/UART1_TXD  (via drill 0.3)
  Top 0.203: U1.1 14.6,17.52 16.64,19.56 22.35,19.56 23.75,20.95 v31.11,20.95
  Bottom 0.203: P9.24 v31.11,20.95
GPIO_30/DSM  (via drill 0.25)
  Top 0.203: U1.4 16.55,15.58 v17.14,14.99
  Bottom 0.203: P9.11 16.13,1.91 17.02,2.79 17.02,5.46 18.29,6.73 18.29,13.84 v17.14,14.99
GPIO_30/QEP_2B  (1 unrouted)
GPIO_30/UART4_RXD_G  (via drill 0.25)  (1 unrouted)
  Top 0.203: J4.1 24.05,38.91 23.5,38.35 22.29,38.35 C21.1 22.16,38.23 v19.81,38.23 | U1.17 16.55,23.92 17.02,24.38 17.02,25.84 18.61,27.43 v19.81,27.43
  Bottom 0.203: v19.81,27.43 v19.81,38.23
GPIO_31/MDIR_1B/MOTOR1  (via drill 0.25)
  Top 0.203: U1.5 v17.2,15.8
  Bottom 0.203: P9.13 18.41,2.16 19.68,3.43 19.68,6.1 19.43,6.35 19.43,15.49 18.67,16.26 17.65,16.26 v17.2,15.8
GPIO_31/UART4_TXD_G  (via drill 0.25)  (1 unrouted)
  Top 0.203: J4.2 25.26,40.91 24.77,41.4 22.29,41.4 C20.1 20.64,41.34 v20.07,40.77 | U1.16 17.2,23.8 17.53,24.13 17.53,25.41 18.66,26.54 19.81,26.54 v19.94,26.67
  Bottom 0.203: v20.07,40.77 20.07,38.99 20.45,38.61 20.45,27.18 v19.94,26.67
GPIO_44/QEP_2A  (1 unrouted)
GPIO_46/PRU_ENC_A  (1 unrouted)
GPIO_47/PRU_ENC_B  (1 unrouted)
GPIO_50/EHRPWM1A_G  (1 unrouted)
  Top 0.203: J6.2 42.75,26.3 C26.1 41.21,26.1 39.37,24.26 36.88,24.26 J7.1 35.23,24.3 34.04,23.11 32.45,23.11 C30.1 31.94,22.61 23.5,22.61 21.97,21.08 19.94,21.08 19.14,21.89 U1.13
GPIO_50/PWM1A/MOTOR_1  (via drill 0.25)
  Top 0.203: U1.8 19.15,15.98 v18.67,15.49
  Bottom 0.203: P9.14 18.41,4.95 18.92,5.46 18.92,14.73 18.67,14.99 v18.67,15.49
GPIO_51/EHRPWM1B_G  (1 unrouted)
  Top 0.203: J7.2 32.59,26.3 C29.1 31.43,26.1 29.72,24.38 26.75,24.38 J8.1 26.08,24.3 24.89,23.11 22.29,23.11 C33.1 22.23,21.97 21.72,21.46 20.19,21.46 19.79,21.87 U1.12
GPIO_51/PWM1B/MOTOR_2  (via drill 0.25)
  Top 0.203: U1.9 19.8,16.01 v19.81,16
  Bottom 0.203: P9.16 20.95,5.46 19.94,6.48 19.94,15.88 v19.81,16
GPIO_72/MDIR_3B/MOTOR_3/BOOTMODE_BTN
  Top 0.203: P8.43 56.52,49.02 61.02,44.51 61.09,44.45 61.85,43.69 R14.1
GPIO_115/QEP_0B  (via drill 0.3)  (1 unrouted)
  Top 0.203: U1.6 17.85,17.85 18.67,18.67 22.73,18.67 23.75,19.68 v33.15,19.68
  Bottom 0.203: P9.27 36.07,1.91 34.92,3.05 34.92,4.83 32.51,7.24 32.51,16.51 33.15,17.14 v33.15,19.68
GPIO_115/QEP_0B_G  (via drill 0.25)  (1 unrouted)
  Top 0.203: J3.1 35.1,38.91 34.54,38.35 32.45,38.35 C18.1 32.19,38.29 32,38.1 v32,37.72 | U1.18 15.9,24.16 16.38,24.64 16.38,26.02 18.43,28.07 20.09,28.07 21.72,29.69 21.72,31.75 22.23,32.26 v31.5,32.26
  Bottom 0.203: v32,37.72 32,32.77 v31.5,32.26
GPIO_115_G  (1 unrouted)
  Top 0.203: J5.1 57.1,24.26 56.01,24.26 54.8,23.05 C24.1 51.24,21.59 23.75,21.59 22.35,20.19 19.43,20.19 17.85,21.77 U1.15
GPIO_117/IMU_INT  (via drill 0.3)
  Top 0.203: U1.7 18.5,17.74 18.92,18.16 22.86,18.16 23.75,19.05 v31.88,19.05
  Bottom 0.203: P9.25 32.38,3.17 32.38,5.21 31.62,5.97 31.62,18.8 v31.88,19.05
GPIO_117_G  (1 unrouted)
  Top 0.203: J5.2 56.94,26.1 C23.1 50.74,26.1 48.9,24.26 47.04,24.26 J6.1 45.74,23.05 C27.1 41.59,22.1 23.62,22.1 22.23,20.7 19.68,20.7 18.49,21.9 U1.14
I2C2_SCL  (via drill 0.25)
  Top 0.203: Q1.2 16.38,9.65 16,9.27 16,8.83 | 16,8.83 R16.1 17.46,6.99 v20.83,6.99 | 16,8.83 16,8.51 | v65.02,16.76 U4.6 | v29.34,17.78 33.02,17.78 33.66,18.41 v65.02,18.41
  Bottom 0.203: v29.34,17.78 29.34,8.64 27.3,6.6 27.3,3.3 26.04,2.03 P9.19 24.77,3.17 24.77,5.33 23.11,6.99 v20.83,6.99 | v65.02,18.41 v65.02,16.76
I2C2_SCL_G
  Top 0.203: J9.1 56.53,9.08 C36.1 52.13,9.08 51.44,9.78 47.07,9.78 J10.1 45.01,9.7 44.45,9.14 42.74,9.14 C39.1 41.59,8.95 40.77,9.78 36.91,9.78 J11.1 35.1,9.7 34.54,9.14 32.58,9.14 C44.1 32.07,9.27 28.07,9.27 27.64,9.7 J12.1 26.05,9.08 C47.1 21.65,9.08 21.34,9.4 21.34,10.29 20.57,11.05 16.51,11.05 Q1.3 15.49,13.14 R15.1
I2C2_SDA  (via drill 0.25)
  Top 0.203: 19.94,9.65 Q2.2 19.56,9.65 19.56,8.7 R18.1 20.51,7.62 v21.59,7.62 | U4.5 v63.75,16.76 | v63.75,19.05 33.53,19.05 32.89,18.41 v28.7,18.41
  Bottom 0.203: P9.20 26.04,7.37 | 26.04,7.37 26.04,7.62 | v21.59,7.62 25.78,7.62 | 25.78,7.62 26.04,7.62 | 26.04,7.62 26.29,7.62 | 26.29,7.62 27.43,7.62 28.7,8.89 v28.7,18.41 | 26.04,7.37 25.78,7.62 | 26.04,7.37 26.29,7.62 | v63.75,16.76 v63.75,19.05
I2C2_SDA_G
  Top 0.203: J9.2 56.72,12.13 C35.1 51.12,12.13 50.67,11.68 47.01,11.68 J10.2 44.94,11.7 44.45,12.19 42.61,12.19 C38.1 37.26,12.13 J11.2 34.02,11.7 33.53,12.19 32.45,12.19 C43.1 27.1,12.13 J12.2 23.61,11.7 23.24,12.06 22.29,12.06 C46.1 22.16,12.06 Q2.3 18.54,12.57 R17.1
N$1
  Top 0.203: U4.1 67.56,22.99 | 67.56,22.99 67.56,23.11 | 67.56,23.11 67.56,23.37 | R31.1 67.37,23.18 | 67.37,23.18 67.5,23.18 67.56,23.11 | 67.37,23.18 67.56,23.37 | 67.37,23.18 67.56,22.99 | 67.56,23.37 67.56,24.77 66.93,25.4 SW2.2
N$2  (via drill 0.25)
  Top 0.203: R32.1 v65.66,22.48 65.66,22.1 66.29,21.46 U4.2 | v64.39,25.4 SW2.1
  Bottom 0.203: v65.66,22.48 65.66,24.13 v64.39,25.4
N$3
  Top 0.203: K2.1 K2.2 66.6,43.19 R14.2
N$4
  Top 0.406: PWR.+ R1.2
N$5
  Top 0.203: U2.3 16.91,41.04 17.27,41.4 R3.2 R2.2
N$8
  Top 0.203: U2.10 15.61,32.62 15.11,32.13 R4.2 R5.2
N$10  (via drill 0.25)
  Top 0.203: J1.1 54.66,38.91 54.1,38.35 52.77,38.35 C11.1 52.01,38.29 v51.94,38.23 | v51.31,46.1 50.8,46.1 50.67,46.23 20.07,46.23 18.41,44.58 R2.1
  Bottom 0.203: v51.94,38.23 51.94,38.48 51.31,39.12 v51.31,46.1
N$11
  Top 0.203: U2.2 17.56,40.8 18.29,41.53 18.61,41.53 18.99,41.91 18.99,42.99 19.24,43.24 R6.1
N$12
  Top 0.203: U4.7 66.29,14.73 65.79,14.22 64.64,14.22 64.2,13.78 R30.2 64.2,12.01 J13.1
N$13  (via drill 0.25)
  Top 0.203: J2.1 46.94,38.86 44.32,38.86 43.75,38.29 C15.1 v42.55,37.59 | R4.1 15.11,29.97 15.88,29.21 20.19,29.21 20.7,29.72 20.7,32.52 21.96,33.78 39.12,33.78 39.5,33.4 v42.55,33.4
  Bottom 0.203: v42.55,37.59 v42.55,33.4
N$16
  Top 0.203: U2.9 14.96,32.86 13.84,31.75 13.84,31.43 R7.1
N$17
  Top 0.203: U4.3 65.02,22.54 R33.1
N$21  (via drill 0.25)
  Top 0.203: J2.2 46.56,41.34 C14.1 41.85,41.34 v41.78,41.27 | R11.1 18.54,30.23 19.05,29.72 20.07,29.72 20.32,29.97 20.32,33.02 21.46,34.16 41.59,34.16 v41.78,33.97
  Bottom 0.203: v41.78,41.27 v41.78,33.97
N$22
  Top 0.203: U2.12 16.91,31.8 R12.2 R11.2
N$24  (via drill 0.25)
  Top 0.203: J1.2 54.85,40.91 54.48,41.27 52.77,41.27 C10.1 52.64,41.4 v51.94,41.4 | R8.1 13.84,43.81 16.76,46.74 v51.94,46.74
  Bottom 0.203: v51.94,46.74 v51.94,41.4
N$25
  Top 0.203: R8.2 R9.2 14.99,41.02 15.61,40.4 U2.5
N$26
  Top 0.203: U2.6 14.96,40.16 13.27,41.85 13.27,42.86 12.89,43.24 R10.1
N$27
  Top 0.203: U2.13 17.56,32.48 18.03,32 18.92,32 19.11,31.81 19.11,30.67 19.37,30.42 R13.1
NC
  Top 0.203: J8.2 22.43,26.3 C32.1
SYS_5V
  Top 0.61: FB2.1 10.73,11.05 C6.1 10.67,4.57 P9.8 P9.7
VDD_3V3B
  Top 0.61: FB1.1 8.45,11.05 C3.1 8.51,7.62 5.71,4.83 P9.4 P9.3
VDD_ADC  (via drill 0.25)
  Top 0.406: D2.2 11.05,38.35 | C48.1 32.38,6.48 | 32.38,6.48 32.38,6.1 | 32.38,6.48 32,6.1 | 32.38,6.48 32.77,6.1
  Top 0.508: P9.32 41.27,4.83 40.01,6.1 32.77,6.1 32.38,6.1 32,6.1 v13.34,6.1 | D2.2 11.3,37.97 10.16,36.83 8.51,36.83 v8,37.34 D1.2 | D4.2 v8,32.38 8.26,32.13 10.67,32.13 v10.92,32.38 10.92,33.02 11.3,33.4 D3.2
  Bottom 0.508: v13.34,6.1 13.34,16.13 12.19,17.27 12.19,24.51 10.92,25.78 v10.92,32.38 | v8,32.38 v8,37.34
VDD_G  (via drill 0.25, 0.3)  (2 unrouted)
  Top 0.406: R15.2 16.57,14.54 16.76,14.35 17.78,14.35 17.91,14.48 18.48,14.48 R17.2 22.1,14.54 C45.1 | U1.19 15.25,25.2 C2.1 15.68,25.21 v15.75,25.27 | R1.1 11.24,41.72 v12.45,40.51
  Top 0.61: J1.3 54.09,42.91 53.98,42.8 52.77,42.8 C12.1 47.04,42.86 J2.3 46.94,42.86 C13.1 42.5,42.91 J3.3 32.43,42.91 C16.1 26.72,42.86 J4.3 26.62,42.86 C19.1 21.53,42.86 v21.46,42.8 | J5.3 57.13,28.32 54.99,28.32 54.42,27.75 C22.1 52.64,27.69 49.91,27.69 49.29,28.3 J6.3 46.88,28.19 44.32,28.19 43.88,27.75 C25.1 42.48,27.69 39.75,27.69 39.13,28.3 J7.3 36.72,28.19 34.04,28.19 33.59,27.75 C28.1 32.32,27.69 30.48,27.69 29.86,28.3 J8.3 26.56,28.19 24.26,28.19 23.81,27.75 C31.1 21.78,27.75 21.34,27.3 v21.34,25.15 | J9.3 57.07,13.78 C34.1 52.63,13.7 J10.3 46.91,13.78 C37.1 42.47,13.7 J11.3 36.75,13.78 C42.1 32.31,13.7 J12.3 26.53,13.84 24.51,13.84 23.69,14.67 C45.1 v22.23,15.37 | SW1.COM v13.08,26.54
  Bottom 0.61: v22.23,15.37 22.23,20.83 21.46,21.59 21.46,25.02 v21.34,25.15 15.88,25.15 v15.75,25.27 14.35,25.27 v13.08,26.54 12.45,27.18 12.45,40.13 | v21.46,42.8 18.16,42.8 16,40.64 12.95,40.64 | 12.95,40.64 12.57,40.64 v12.45,40.51 12.45,40.13 | 12.95,40.64 12.45,40.13

### Text on the board
tPlace: 2 | 1 | 20 | 40 | GND | GND | GND | GND | VCC | VCC | VCC | VCC | GND | GND | GND | 3V3 | VCC | GND | VCC | VCC | VCC | 5V | GND | VCC | SDA | SCL | 20 | 40 | 2 | 1
bPlace: www.seeedstudio.com | by Seeed Studio | v2.0 03/04/2016 | Grove Base Cape for BeagleBone
tNames: PWR | AIN2 | AIN0 | UART4 | UART1 | 31 | 15 | A3 | A1 | USER | 30 | 14 | A2 | A0 | UART/Digital | Analog Input | 0 | Digital I/O | VCC | NC | 51 | 50 | 117 | 1 | 51 | 50 | 117 | 115 | GPIO_51 | GPIO_50 | GPIO_117 | GPIO_115 | I2C_2 | WP
bNames: SW2 sets the / Cape I2C Address: / 00: 0x54 / 01: 0x55 / 10: 0x56 / 11: 0x57 | Short to disable / write protection